# Altium project ALCT_MEZ_LX100.PrjPcb (part 3 of 8)

## Sheet Power.SchDoc: Power
size B; Organization: UCLA High Energy Physics; DocumentNumber: 7; Revision: 2.0; SheetNumber: 7; SheetTotal: 23; CurrentDate: 9/6/2018; ModifiedDate: 9/6/2018; Rule: PcbType=ProtelPcb
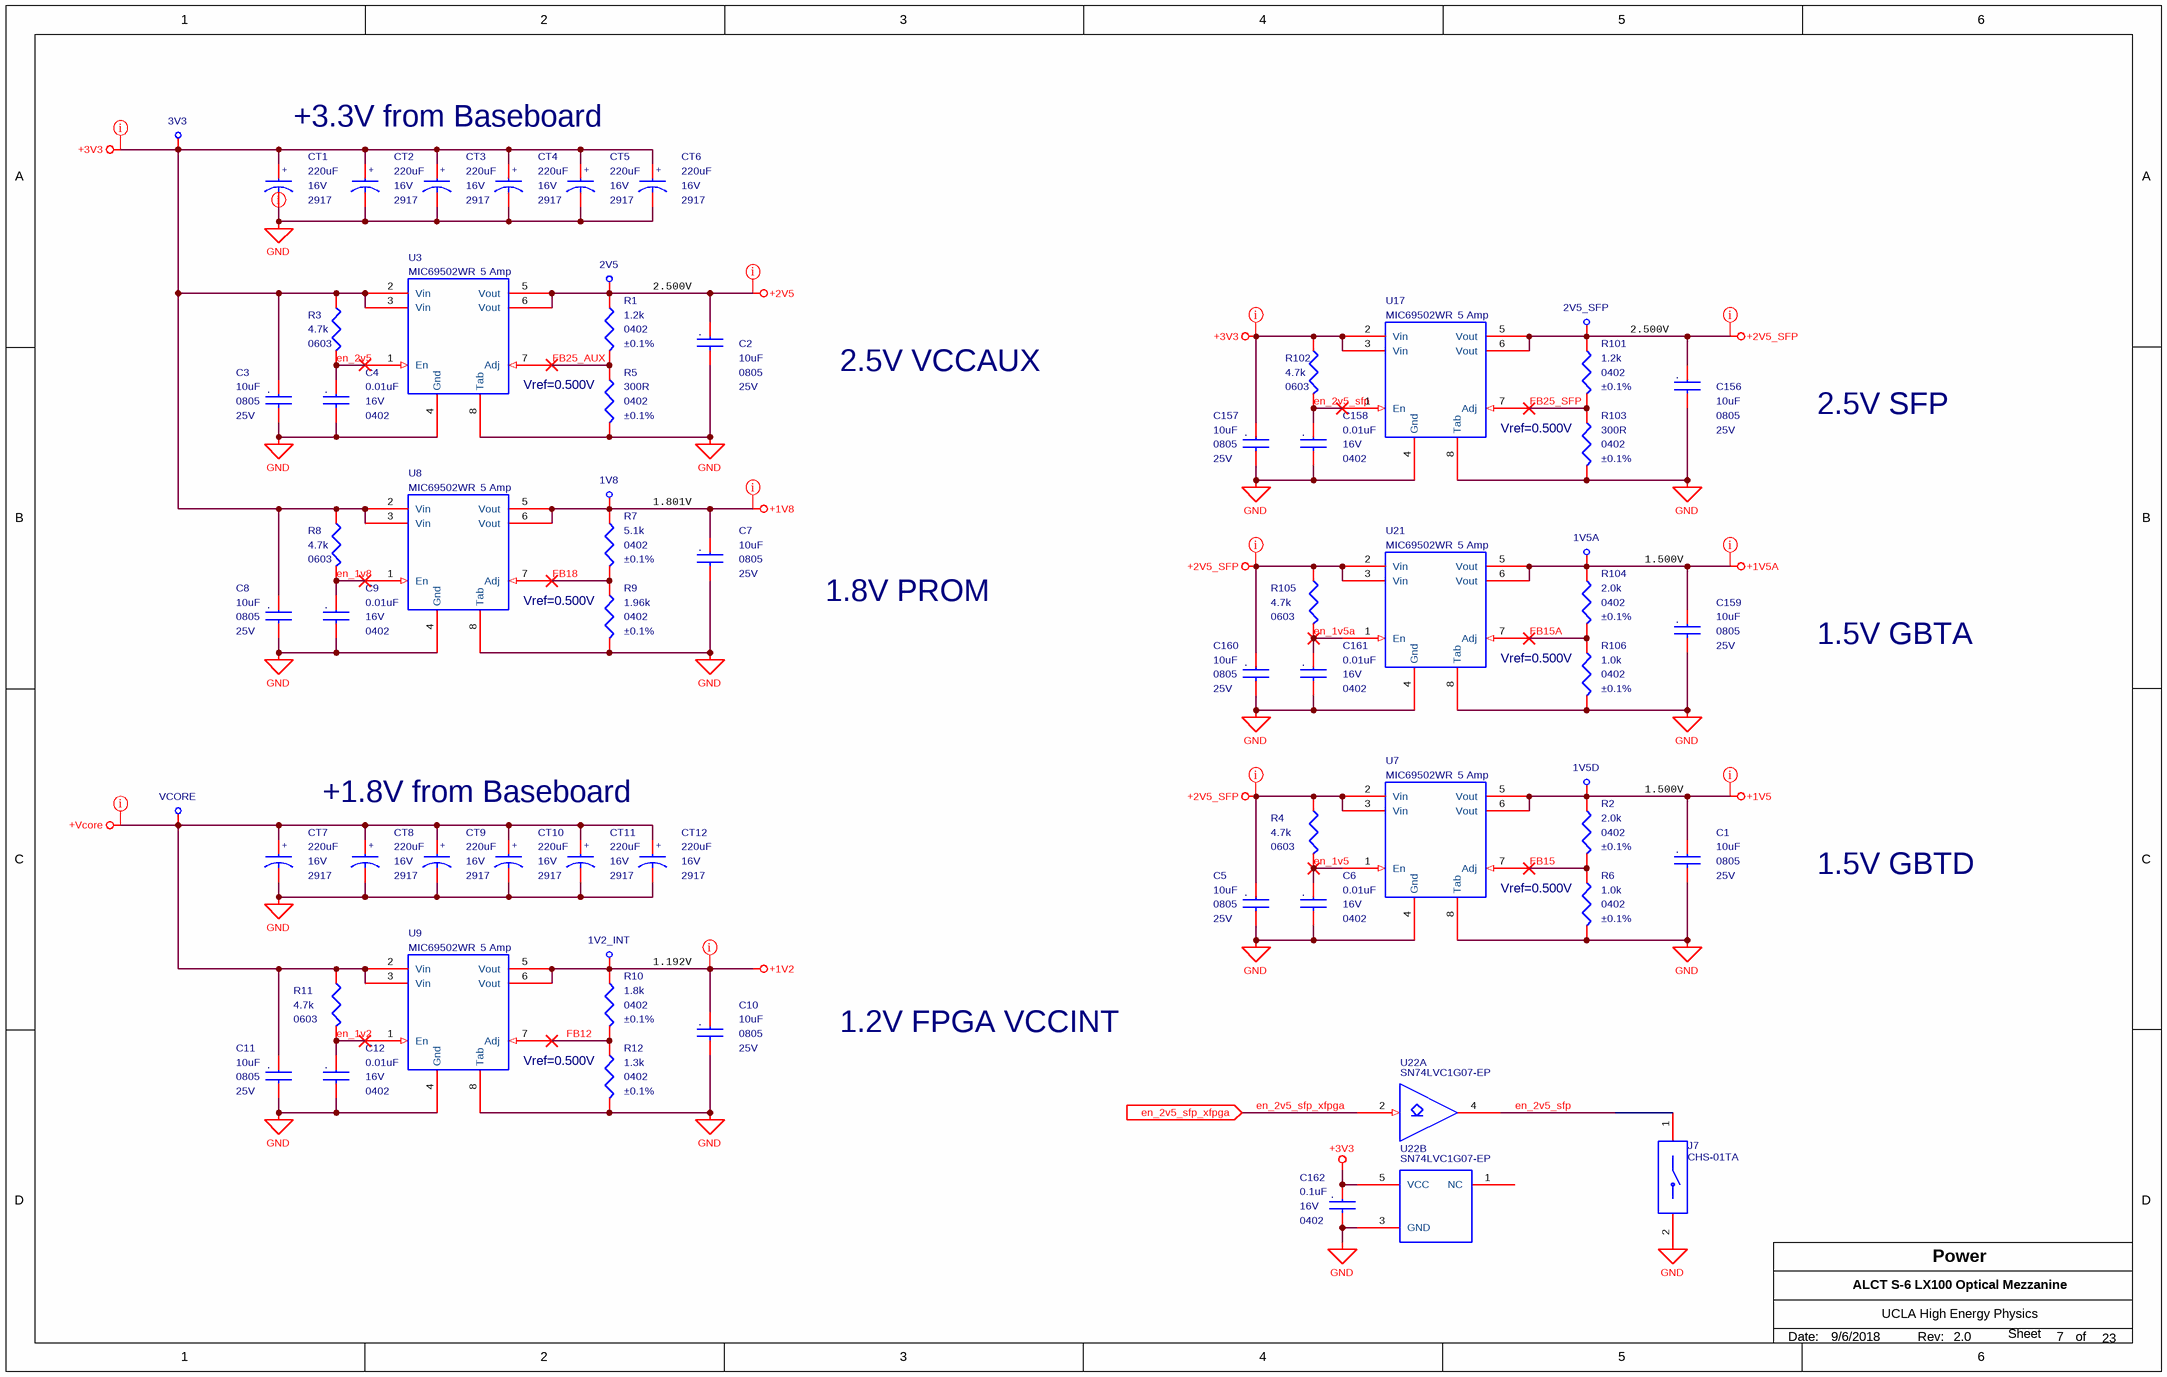
[diagram p12: Power.SchDoc]

### Parts
1V2_INT  Test Point Via  [MC_S6/TH/TPVIA]  (value not drawn)  (no BOM)
1V5A  Test Point Via  [MC_S6/TH/TPVIA]  (value not drawn)  (no BOM)
1V5D  Test Point Via  [MC_S6/TH/TPVIA]  (value not drawn)  (no BOM)
1V8  Test Point Via  [MC_S6/TH/TPVIA]  (value not drawn)  (no BOM)
2V5  Test Point Via  [MC_S6/TH/TPVIA]  (value not drawn)  (no BOM)
2V5_SFP  Test Point Via  [MC_S6/TH/TPVIA]  (value not drawn)  (no BOM)
3V3  Test Point Via  [MC_S6/TH/TPVIA]  (value not drawn)  (no BOM)
C1  10uF  Voltage - Rated: 25V  package: 0805  [MC_S6/SM/C_0805_IPC]
C2  10uF  Voltage - Rated: 25V  package: 0805  [MC_S6/SM/C_0805_IPC]
C3  10uF  Voltage - Rated: 25V  package: 0805  [MC_S6/SM/C_0805_IPC]
C4  0.01uF  Voltage - Rated: 16V  package: 0402  [MC_S6/SM/C_0402_IPC]
C5  10uF  Voltage - Rated: 25V  package: 0805  [MC_S6/SM/C_0805_IPC]
C6  0.01uF  Voltage - Rated: 16V  package: 0402  [MC_S6/SM/C_0402_IPC]
C7  10uF  Voltage - Rated: 25V  package: 0805  [MC_S6/SM/C_0805_IPC]
C8  10uF  Voltage - Rated: 25V  package: 0805  [MC_S6/SM/C_0805_IPC]
C9  0.01uF  Voltage - Rated: 16V  package: 0402  [MC_S6/SM/C_0402_IPC]
C10  10uF  Voltage - Rated: 25V  package: 0805  [MC_S6/SM/C_0805_IPC]
C11  10uF  Voltage - Rated: 25V  package: 0805  [MC_S6/SM/C_0805_IPC]
C12  0.01uF  Voltage - Rated: 16V  package: 0402  [MC_S6/SM/C_0402_IPC]
C156  10uF  Voltage - Rated: 25V  package: 0805  [MC_S6/SM/C_0805_IPC]
C157  10uF  Voltage - Rated: 25V  package: 0805  [MC_S6/SM/C_0805_IPC]
C158  0.01uF  Voltage - Rated: 16V  package: 0402  [MC_S6/SM/C_0402_IPC]
C159  10uF  Voltage - Rated: 25V  package: 0805  [MC_S6/SM/C_0805_IPC]
C160  10uF  Voltage - Rated: 25V  package: 0805  [MC_S6/SM/C_0805_IPC]
C161  0.01uF  Voltage - Rated: 16V  package: 0402  [MC_S6/SM/C_0402_IPC]
C162  0.1uF  package: 0402  Voltage - Rated: 16V  [MC_S6/SM/C_0402_IPC]
CT1  220uF  Voltage - Rated: 16V  package: 2917  [MC_S6/SM/CT_2917_D]
CT2  220uF  Voltage - Rated: 16V  package: 2917  [MC_S6/SM/CT_2917_D]
CT3  220uF  Voltage - Rated: 16V  package: 2917  [MC_S6/SM/CT_2917_D]
CT4  220uF  Voltage - Rated: 16V  package: 2917  [MC_S6/SM/CT_2917_D]
CT5  220uF  Voltage - Rated: 16V  package: 2917  [MC_S6/SM/CT_2917_D]
CT6  220uF  Voltage - Rated: 16V  package: 2917  [MC_S6/SM/CT_2917_D]
CT7  220uF  Voltage - Rated: 16V  package: 2917  [MC_S6/SM/CT_2917_D]
CT8  220uF  Voltage - Rated: 16V  package: 2917  [MC_S6/SM/CT_2917_D]
CT9  220uF  Voltage - Rated: 16V  package: 2917  [MC_S6/SM/CT_2917_D]
CT10  220uF  Voltage - Rated: 16V  package: 2917  [MC_S6/SM/CT_2917_D]
CT11  220uF  Voltage - Rated: 16V  package: 2917  [MC_S6/SM/CT_2917_D]
CT12  220uF  Voltage - Rated: 16V  package: 2917  [MC_S6/SM/CT_2917_D]
J7  CHS-01TA  [CHS-01TA]
R1  1.2k  Tolerance: ±0.1%  package: 0402  [MC_S6/SM/R_0402_IPC]
R2  2.0k  Tolerance: ±0.1%  package: 0402  [MC_S6/SM/R_0402_IPC]
R3  4.7k  Supplier Device Package: 0603  [MC_S6/SM/R_0603_IPC]
R4  4.7k  Supplier Device Package: 0603  [MC_S6/SM/R_0603_IPC]
R5  300R  Tolerance: ±0.1%  package: 0402  [MC_S6/SM/R_0402_IPC]
R6  1.0k  Tolerance: ±0.1%  package: 0402  [MC_S6/SM/R_0402_IPC]
R7  5.1k  Tolerance: ±0.1%  Supplier Device Package: 0402  [MC_S6/SM/R_0402_IPC]
R8  4.7k  Supplier Device Package: 0603  [MC_S6/SM/R_0603_IPC]
R9  1.96k  Tolerance: ±0.1%  package: 0402  [MC_S6/SM/R_0402_IPC]
R10  1.8k  Tolerance: ±0.1%  Supplier Device Package: 0402  [MC_S6/SM/R_0402_IPC]
R11  4.7k  Supplier Device Package: 0603  [MC_S6/SM/R_0603_IPC]
R12  1.3k  Tolerance: ±0.1%  Supplier Device Package: 0402  [MC_S6/SM/R_0402_IPC]
R101  1.2k  Tolerance: ±0.1%  package: 0402  [MC_S6/SM/R_0402_IPC]
R102  4.7k  Supplier Device Package: 0603  [MC_S6/SM/R_0603_IPC]
R103  300R  Tolerance: ±0.1%  package: 0402  [MC_S6/SM/R_0402_IPC]
R104  2.0k  Tolerance: ±0.1%  package: 0402  [MC_S6/SM/R_0402_IPC]
R105  4.7k  Supplier Device Package: 0603  [MC_S6/SM/R_0603_IPC]
R106  1.0k  Tolerance: ±0.1%  package: 0402  [MC_S6/SM/R_0402_IPC]
U3  MIC69502WR  [MC_S6/SM/SPAK7]
U7  MIC69502WR  [MC_S6/SM/SPAK7]
U8  MIC69502WR  [MC_S6/SM/SPAK7]
U9  MIC69502WR  [MC_S6/SM/SPAK7]
U17  MIC69502WR  [MC_S6/SM/SPAK7]
U21  MIC69502WR  [MC_S6/SM/SPAK7]
U22  SN74LVC1G07-EP  [SOT353-1]  (parts A,B of 2)
VCORE  Test Point Via  [MC_S6/TH/TPVIA]  (value not drawn)  (no BOM)

### Ports
en_2v5_sfp_xfpga (in)

### Nets
+1V2: 1V2_INT.1(In) C10.1 R10.1 U9.5(Vout) U9.6(Vout)
+1V5: 1V5D.1(In) C1.1 R2.1 U7.5(Vout) U7.6(Vout)
+1V5A: 1V5A.1(In) C159.1 R104.1 U21.5(Vout) U21.6(Vout)
+1V8: 1V8.1(In) C7.1 R7.1 U8.5(Vout) U8.6(Vout)
+2V5: 2V5.1(In) C2.1 R1.1 U3.5(Vout) U3.6(Vout)
+2V5_SFP: 2V5_SFP.1(In) C5.1 C156.1 C160.1 R4.1 R101.1 R105.1 U7.2(Vin) U7.3(Vin) U17.5(Vout) U17.6(Vout) U21.2(Vin) U21.3(Vin)
+3V3: 3V3.1(In) C3.1 C8.1 C157.1 C162.1 CT1.1 CT2.1 CT3.1 CT4.1 CT5.1 CT6.1 R3.1 R8.1 R102.1 U3.2(Vin) U3.3(Vin) U8.2(Vin) U8.3(Vin) U17.2(Vin) U17.3(Vin) U22.5(VCC)
+Vcore: C11.1 CT7.1 CT8.1 CT9.1 CT10.1 CT11.1 CT12.1 R11.1 U9.2(Vin) U9.3(Vin) VCORE.1(In)
GND: C1.2 C2.2 C3.2 C4.2 C5.2 C6.2 C7.2 C8.2 C9.2 C10.2 C11.2 C12.2 C156.2 C157.2 C158.2 C159.2 C160.2 C161.2 C162.2 CT1.2 CT2.2 CT3.2 CT4.2 CT5.2 CT6.2 CT7.2 CT8.2 CT9.2 CT10.2 CT11.2 CT12.2 J7.2 R5.2 R6.2 R9.2 R12.2 R103.2 R106.2 U3.4(Gnd) U3.8(Tab) U7.4(Gnd) U7.8(Tab) U8.4(Gnd) U8.8(Tab) U9.4(Gnd) U9.8(Tab) U17.4(Gnd) U17.8(Tab) U21.4(Gnd) U21.8(Tab) U22.3(GND)
en_1v2: C12.1 R11.2 U9.1(En)
en_1v5: C6.1 R4.2 U7.1(En)
en_1v5a: C161.1 R105.2 U21.1(En)
en_1v8: C9.1 R8.2 U8.1(En)
en_2v5: C4.1 R3.2 U3.1(En)
en_2v5_sfp: C158.1 J7.1 R102.2 U17.1(En) U22.4(Y)
en_2v5_sfp_xfpga: U22.2(A) ; port en_2v5_sfp_xfpga
FB12: R10.2 R12.1 U9.7(Adj)
FB15: R2.2 R6.1 U7.7(Adj)
FB15A: R104.2 R106.1 U21.7(Adj)
FB18: R7.2 R9.1 U8.7(Adj)
FB25_AUX: R1.2 R5.1 U3.7(Adj)
FB25_SFP: R101.2 R103.1 U17.7(Adj)

Not connected (* = marked no-connect by the designer): U22 1(NC)

### Layout directives
net class Power: +1V2, +1V5, +1V5A, +1V8, +2V5, +2V5_SFP, +3V3, +Vcore, GND

### Notes on the sheet
- +3.3V from Baseboard
- (near U3) 5 Amp
- 2.500V
- (near U17) 5 Amp
- Vref=0.500V
- 2.5V VCCAUX
- 2.5V SFP
- (near U8) 5 Amp
- 1.801V
- 1.8V PROM
- (near U21) 5 Amp
- 1.500V
- 1.5V GBTA
- +1.8V from Baseboard
- (near U7) 5 Amp
- 1.5V GBTD
- (near U9) 5 Amp
- 1.192V
- 1.2V FPGA VCCINT
- Date:
- Rev:
- of
- Sheet
- (in symbol C0402C103K4RACTU) .
- (in symbol C0402C104K4RACTU) .
- (in symbol GRM21BR61E106KA73L) .
- (in symbol T491D227K016AT) +

### Library data of the parts
1V2_INT 1V5A 1V5D 1V8 2V5 2V5_SFP 3V3 VCORE = TPVIA: COMPSIDE: TOP; COMPGROUP: 0; mfgr: Layout; COMPROT: 0; Package: 90; mfgr_id: TPVIA; mfgr_foot: TPVIA
C1-C3 C5 C7 C8 C10 C11 C156 C157 C159 C160 = GRM21BR61E106KA73L: CAP CER 10UF 25V X5R 0805; Manufacturer: Murata Electronics North America; Capacitance: 10µF; Tolerance: ±10%; Supplier 1: Digi-Key; Manufacturer Part Number: GRM21BR61E106KA73L; RoHS: RoHS Compliant; Category: Capacitors; Stock 1: 607428; Pricing 1: 1=0.19, 10=0.13, 50=0.0748, 100=0.0618, 250=0.052, 500=0.04356, 1000=0.03575 (USD); Packaging: Cut Tape (CT); Part Status: Active; Temperature Coefficient: X5R; Operating Temperature: -55°C ~ 85°C; Features: -; Ratings: -; Applications: General Purpose; Mounting Type: Surface Mount, MLCC; Package / Case: 0805 (2012 Metric); Size / Dimension: 0.079" L x 0.049" W (2.00mm x 1.25mm); Height - Seated (Max): -; Thickness (Max): 0.053" (1.35mm); Lead Spacing: -; Lead Style: -; ComponentLink1URL: http://www.murata.com/~/media/webrenewal/support/library/catalog/products/capacitor/mlcc/c02e.pdf; ComponentLink1Description: http://www.murata.com/~/media/webrenewal/support/library/catalog/products/capacitor/mlcc/c02e.pdf; Supplier 2: Digi-Key; Supplier Part Number 1: 490-5523-1-ND; Supplier Part Number 2: 490-5523-6-ND
C4 C6 C9 C12 C158 C161 = C0402C103K4RACTU: CAP CER 10nF 16V X7R 0402; Manufacturer: KEMET; Capacitance: 10000pF; Tolerance: ±10%; Supplier 1: Digi-Key; Manufacturer Part Number: C0402C103K4RACTU; RoHS: RoHS Compliant; Category: Capacitors; Stock 1: 605739; Pricing 1: 1=0.1, 10=0.02, 25=0.0144, 50=0.0108, 100=0.0088, 250=0.00732, 500=0.00626, 1000=0.00492, 5000=0.00412 (USD); Packaging: Cut Tape (CT); Part Status: Active; Temperature Coefficient: X7R; Operating Temperature: -55°C ~ 125°C; Features: -; Ratings: -; Applications: General Purpose; Failure Rate: -; Mounting Type: Surface Mount, MLCC; Package / Case: 0402 (1005 Metric); Size / Dimension: 0.039" L x 0.020" W (1.00mm x 0.50mm); Height - Seated (Max): -; Thickness (Max): 0.022" (0.55mm); Lead Spacing: -; Lead Style: -; ComponentLink1URL: http://www.kemet.com/docfinder?Partnumber=C0402C103K4RACTU; ComponentLink1Description: http://www.kemet.com/docfinder?Partnumber=C0402C103K4RACTU; Supplier 2: Digi-Key; Stock 2: 605739; Pricing 2: 1=0.1, 10=0.02, 25=0.0144, 50=0.0108, 100=0.0088, 250=0.00732, 500=0.00626, 1000=0.00492, 5000=0.00412 (USD); Supplier Part Number 1: 399-1038-1-ND; Supplier Part Number 2: 399-1038-6-ND
C162 = C0402C104K4RACTU: CAP CER 0.1UF 16V X7R 0402; Manufacturer: KEMET; Capacitance: 0.10µF; Tolerance: ±10%; Supplier 1: Digi-Key; Manufacturer Part Number: C0402C104K4RACTU; RoHS: RoHS Compliant; Category: Capacitors; Stock 1: 3565698; Pricing 1: 1=0.11, 10=0.078, 25=0.0568, 50=0.0442, 100=0.0365, 250=0.03024, 500=0.02562, 1000=0.02121, 5000=0.01806 (USD); Packaging: Cut Tape (CT); Part Status: Active; Operating Temperature: -55°C ~ 125°C; Features: -; Ratings: -; Applications: General Purpose; Failure Rate: -; Mounting Type: Surface Mount, MLCC; Package / Case: 0402 (1005 Metric); Size / Dimension: 0.039" L x 0.020" W (1.00mm x 0.50mm); Height - Seated (Max): -; Thickness (Max): 0.022" (0.55mm); Lead Spacing: -; Lead Style: -; ComponentLink1URL: http://www.kemet.com/docfinder?Partnumber=C0402C104K4RACTU; ComponentLink1Description: http://www.kemet.com/docfinder?Partnumber=C0402C104K4RACTU; Supplier 2: Digi-Key; Stock 2: 3565998; Pricing 2: 1=0.11, 10=0.078, 25=0.0568, 50=0.0442, 100=0.0365, 250=0.03024, 500=0.02562, 1000=0.02121, 5000=0.01806 (USD); Supplier Part Number 1: 399-3521-1-ND; Supplier Part Number 2: 399-3521-6-ND; Temperature Coefficient: X7R
CT1-CT12 = T491D227K016AT: CAP TANT 220UF 16V 10% 2917; Manufacturer: KEMET; Manufacturer Size Code: D; Capacitance: 220µF; ESR (Equivalent Series Resistance): 500 mOhm; Lifetime @ Temp.: 2000 Hrs @ 85°C; Supplier 1: Digi-Key; Manufacturer Part Number: T491D227K016AT; RoHS: RoHS Compliant; Category: Capacitors; Stock 1: 48724; Pricing 1: 1=1.28, 10=1.009, 25=0.9248, 50=0.8744, 100=0.7568, 250=0.67268 (USD); Packaging: Cut Tape (CT); Part Status: Active; Tolerance: ±10%; Type: Molded; Operating Temperature: -55°C ~ 125°C; Mounting Type: Surface Mount; Package / Case: 2917 (7343 Metric); Size / Dimension: 0.287" L x 0.169" W (7.30mm x 4.30mm); Height - Seated (Max): 0.122" (3.10mm); Lead Spacing: -; Features: General Purpose; Failure Rate: -; ComponentLink1URL: http://www.kemet.com/Lists/ProductCatalog/Attachments/254/KEM_T2005_T491.pdf; ComponentLink1Description: http://www.kemet.com/Lists/ProductCatalog/Attachments/254/KEM_T2005_T491.pdf; Supplier 2: Digi-Key; Stock 2: 48724; Pricing 2: 1=1.28, 10=1.009, 25=0.9248, 50=0.8744, 100=0.7568, 250=0.67268 (USD); Supplier Part Number 1: 399-10429-1-ND; Supplier Part Number 2: 399-10429-6-ND
J7 = CHS-01TA: SWITCH SLIDE DIP SPST 100MA 6V; Manufacturer: Nidec Copal; Body Material: Polyphenylene; Number of Positions: 1; Electrical Life: 2000Cycles; Max Voltage Rating (DC): 24V; Pitch: 0.05inch; Washable: Yes; ComponentLink1URL: https://www.ctscorp.com/wp-content/uploads/219.pdf; ComponentLink1Description: https://www.ctscorp.com/wp-content/uploads/219.pdf; Supplier 1: Digi-Key; Manufacturer Part Number: CHS-01TA; Stock 1: 148558; Pricing 1: 1=0.98, 10=0.961, 25=0.9056, 50=0.85, 100=0.8131, 250=0.77616, 500=0.70224 (USD); Mount: Surface Mount; Contact Material: Copper Alloy; Contact Plating: Gold; Min Operating Temperature: -40°C; Max Operating Temperature: 85°C; Packaging: Tape and Reel; Throw Configuration: SPST; Voltage Rating (DC): 6V; Current Rating: 100mA; Termination: J-Hook; Orientation: Vertical; Length: 0.098inch; Lead Free: Lead Free; ComponentLink2URL: https://datasheet.ciiva.com/2863/chs-2863448.pdf; ComponentLink2Description: https://datasheet.ciiva.com/2863/chs-2863448.pdf; ComponentLink3URL: https://datasheet.ciiva.com/2863/chs-2863449.pdf; ComponentLink3Description: https://datasheet.ciiva.com/2863/chs-2863449.pdf; ComponentLink4URL: https://datasheet.ciiva.com/2863/chs-2863450.pdf; ComponentLink4Description: https://datasheet.ciiva.com/2863/chs-2863450.pdf; Supplier Part Number 1: 563-1003-1-ND
R1 R101 = ERA-2AEB122X: RES SMD 1.2K OHM 0.1% 1/16W 0402; Manufacturer: Panasonic Electronic Components; Power (Watts): 0.063W, 1/16W; Temperature Coefficient: ±25ppm/°C; Supplier 1: Digi-Key; Manufacturer Part Number: ERA-2AEB122X; RoHS: RoHS Compliant; Category: Resistors; Stock 1: 25790; Pricing 1: 1=0.45, 10=0.321, 100=0.1283, 1000=0.06322, 2500=0.05858, 5000=0.053 (USD); Packaging: Cut Tape (CT); Part Status: Active; Composition: Thin Film; Features: Automotive AEC-Q200; Operating Temperature: -55°C ~ 155°C; Package / Case: 0402 (1005 Metric); Size / Dimension: 0.039" L x 0.020" W (1.00mm x 0.50mm); Height - Seated (Max): 0.016" (0.40mm); Failure Rate: -; ComponentLink1URL: https://industrial.panasonic.com/cdbs/www-data/pdf/RDM0000/AOA0000C307.pdf; ComponentLink1Description: https://industrial.panasonic.com/cdbs/www-data/pdf/RDM0000/AOA0000C307.pdf; Supplier 2: Digi-Key; Stock 2: 25790; Pricing 2: 1=0.45, 10=0.321, 100=0.1283, 1000=0.06322, 2500=0.05858, 5000=0.053 (USD); Supplier Part Number 1: P1.2KDCCT-ND; Supplier Part Number 2: P1.2KDCDKR-ND; Supplier Device Package: 0402
R2 R104 = ERA-2AEB202X: RES SMD 2.0K OHM 0.1% 1/16W 0402; Manufacturer: Panasonic Electronic Components; Power (Watts): 0.063W, 1/16W; Temperature Coefficient: ±25ppm/°C; Supplier 1: Digi-Key; Manufacturer Part Number: ERA-2AEB202X; RoHS: RoHS Compliant; Category: Resistors; Stock 1: 204508; Pricing 1: 1=0.45, 10=0.321, 100=0.1283, 1000=0.06322, 2500=0.05858, 5000=0.053 (USD); Packaging: Digi-Reel®; Part Status: Active; Composition: Thin Film; Features: Automotive AEC-Q200; Operating Temperature: -55°C ~ 155°C; Package / Case: 0402 (1005 Metric); Size / Dimension: 0.039" L x 0.020" W (1.00mm x 0.50mm); Height - Seated (Max): 0.016" (0.40mm); Failure Rate: -; ComponentLink1URL: https://industrial.panasonic.com/cdbs/www-data/pdf/RDM0000/AOA0000C307.pdf; ComponentLink1Description: https://industrial.panasonic.com/cdbs/www-data/pdf/RDM0000/AOA0000C307.pdf; Supplier 2: Digi-Key; Stock 2: 204508; Pricing 2: 1=0.45, 10=0.321, 100=0.1283, 1000=0.06322, 2500=0.05858, 5000=0.053 (USD); Supplier Part Number 1: P2.0KDCDKR-ND; Supplier Part Number 2: P2.0KDCCT-ND; Supplier Device Package: 0402
R3 R4 R8 R11 R102 R105 = CR0603-FX-4701ELF: RES SMD 4.7K OHM 1% 1/10W 0603; Manufacturer: Bourns Inc.; Power (Watts): 0.1W, 1/10W; Temperature Coefficient: ±100ppm/°C; Tolerance: ±1%; Supplier 1: Digi-Key; Manufacturer Part Number: CR0603-FX-4701ELF; RoHS: RoHS Compliant; Category: Resistors; Stock 1: 43560; Pricing 1: 1=0.1, 10=0.021, 100=0.0086, 1000=0.00385, 2500=0.00334 (USD); Packaging: Cut Tape (CT); Part Status: Active; Resistance (Ohms): 4.7k; Composition: Thick Film; Features: Moisture Resistant; Operating Temperature: -55°C ~ 155°C; Package / Case: 0603 (1608 Metric); Size / Dimension: 0.063" L x 0.031" W (1.60mm x 0.80mm); Height - Seated (Max): 0.022" (0.55mm); Failure Rate: -; ComponentLink1URL: http://www.bourns.com/docs/Product-Datasheets/CHPREZTR.pdf; ComponentLink1Description: http://www.bourns.com/docs/Product-Datasheets/CHPREZTR.pdf; Supplier 2: Digi-Key; Stock 2: 43560; Pricing 2: 1=0.1, 10=0.021, 100=0.0086, 1000=0.00385, 2500=0.00334 (USD); Supplier Part Number 1: CR0603-FX-4701ELFCT-ND; Supplier Part Number 2: CR0603-FX-4701ELFDKR-ND
R5 R103 = ERA-2AEB301X: RES SMD 300 OHM 0.1% 1/16W 0402; Manufacturer: Panasonic Electronic Components; Power (Watts): 0.063W, 1/16W; Temperature Coefficient: ±25ppm/°C; Supplier 1: Digi-Key; Manufacturer Part Number: ERA-2AEB301X; RoHS: RoHS Compliant; Category: Resistors; Stock 1: 31760; Pricing 1: 1=0.45, 10=0.321, 100=0.1283, 1000=0.06322, 2500=0.05858, 5000=0.053 (USD); Packaging: Cut Tape (CT); Part Status: Active; Composition: Thin Film; Features: Automotive AEC-Q200; Operating Temperature: -55°C ~ 155°C; Package / Case: 0402 (1005 Metric); Supplier Device Package: 0402; Size / Dimension: 0.039" L x 0.020" W (1.00mm x 0.50mm); Height - Seated (Max): 0.016" (0.40mm); Failure Rate: -; ComponentLink1URL: https://industrial.panasonic.com/cdbs/www-data/pdf/RDM0000/AOA0000C307.pdf; ComponentLink1Description: https://industrial.panasonic.com/cdbs/www-data/pdf/RDM0000/AOA0000C307.pdf; Supplier 2: Digi-Key; Stock 2: 31760; Pricing 2: 1=0.45, 10=0.321, 100=0.1283, 1000=0.06322, 2500=0.05858, 5000=0.053 (USD); Supplier Part Number 1: P300DCCT-ND; Supplier Part Number 2: P300DCDKR-ND
R6 R106 = ERA-2AEB102X: RES SMD 1.0K OHM 0.1% 1/16W 0402; Manufacturer: Panasonic Electronic Components; Power (Watts): 0.063W, 1/16W; Temperature Coefficient: ±25ppm/°C; Supplier 1: Digi-Key; Manufacturer Part Number: ERA-2AEB102X; RoHS: RoHS Compliant; Category: Resistors; Stock 1: 473705; Pricing 1: 1=0.45, 10=0.321, 100=0.1283, 1000=0.06322, 2500=0.05858, 5000=0.053 (USD); Packaging: Cut Tape (CT); Part Status: Active; Composition: Thin Film; Features: Automotive AEC-Q200; Operating Temperature: -55°C ~ 155°C; Package / Case: 0402 (1005 Metric); Size / Dimension: 0.039" L x 0.020" W (1.00mm x 0.50mm); Height - Seated (Max): 0.016" (0.40mm); Failure Rate: -; ComponentLink1URL: https://industrial.panasonic.com/cdbs/www-data/pdf/RDM0000/AOA0000C307.pdf; ComponentLink1Description: https://industrial.panasonic.com/cdbs/www-data/pdf/RDM0000/AOA0000C307.pdf; Supplier 2: Digi-Key; Stock 2: 473705; Pricing 2: 1=0.45, 10=0.321, 100=0.1283, 1000=0.06322, 2500=0.05858, 5000=0.053 (USD); Supplier Part Number 1: P1.0KDCCT-ND; Supplier Part Number 2: P1.0KDCDKR-ND; Supplier Device Package: 0402
R7 = ERA-2AEB512X: RES SMD 5.1K OHM 0.1% 1/16W 0402; Manufacturer: Panasonic Electronic Components; Power (Watts): 0.063W, 1/16W; Temperature Coefficient: ±25ppm/°C; Supplier 1: Digi-Key; Manufacturer Part Number: ERA-2AEB512X; RoHS: RoHS Compliant; Category: Resistors; Stock 1: 26098; Pricing 1: 1=0.61, 50=0.238, 100=0.1913, 250=0.14876, 500=0.1122, 1000=0.0867, 5000=0.0646 (USD); Packaging: Cut Tape (CT); Part Status: Active; Resistance (Ohms): 5.1k; Composition: Thin Film; Features: Automotive AEC-Q200; Operating Temperature: -55°C ~ 155°C; Package / Case: 0402 (1005 Metric); Size / Dimension: 0.039" L x 0.020" W (1.00mm x 0.50mm); Height - Seated (Max): 0.016" (0.40mm); Failure Rate: -; ComponentLink1URL: https://industrial.panasonic.com/cdbs/www-data/pdf/RDA0000/AOA0000C237.pdf; ComponentLink1Description: https://industrial.panasonic.com/cdbs/www-data/pdf/RDA0000/AOA0000C237.pdf; Supplier 2: Digi-Key; Stock 2: 26098; Pricing 2: 1=0.61, 50=0.238, 100=0.1913, 250=0.14876, 500=0.1122, 1000=0.0867, 5000=0.0646 (USD); Supplier Part Number 1: P5.1KDCCT-ND; Supplier Part Number 2: P5.1KDCDKR-ND; Number of Terminations: 2
R9 = ERA-2AEB1961X: RES SMD 1.96K OHM 0.1% 1/16W 0402; Manufacturer: Panasonic Electronic Components; Power (Watts): 0.063W, 1/16W; Temperature Coefficient: ±25ppm/°C; Supplier 1: Digi-Key; Manufacturer Part Number: ERA-2AEB1961X; RoHS: RoHS Compliant; Category: Resistors; Stock 1: 36796; Pricing 1: 1=0.45, 10=0.321, 100=0.1283, 1000=0.06322, 2500=0.05858, 5000=0.053 (USD); Packaging: Cut Tape (CT); Part Status: Active; Composition: Thin Film; Features: Automotive AEC-Q200; Operating Temperature: -55°C ~ 155°C; Package / Case: 0402 (1005 Metric); Size / Dimension: 0.039" L x 0.020" W (1.00mm x 0.50mm); Height - Seated (Max): 0.016" (0.40mm); Failure Rate: -; ComponentLink1URL: https://industrial.panasonic.com/cdbs/www-data/pdf/RDM0000/AOA0000C307.pdf; ComponentLink1Description: https://industrial.panasonic.com/cdbs/www-data/pdf/RDM0000/AOA0000C307.pdf; Supplier 2: Digi-Key; Stock 2: 36796; Pricing 2: 1=0.45, 10=0.321, 100=0.1283, 1000=0.06322, 2500=0.05858, 5000=0.053 (USD); Supplier Part Number 1: P1.96KDCCT-ND; Supplier Part Number 2: P1.96KDCDKR-ND; Supplier Device Package: 0402
R10 = ERA-2AEB182X: RES SMD 1.8k OHM 0.1% 1/16W 0402; Manufacturer: Panasonic Electronic Components; Power (Watts): 0.063W, 1/16W; Temperature Coefficient: ±25ppm/°C; Supplier 1: Digi-Key; Manufacturer Part Number: ERA-2AEB182X; RoHS: RoHS Compliant; Category: Resistors; Stock 1: 39375; Pricing 1: 1=0.6, 50=0.2484, 100=0.2052, 250=0.162, 500=0.13824, 1000=0.10368, 5000=0.07776 (USD); Packaging: Cut Tape (CT); Part Status: Active; Resistance (Ohms): 1.8k; Composition: Thin Film; Features: Automotive AEC-Q200; Operating Temperature: -55°C ~ 155°C; Package / Case: 0402 (1005 Metric); Size / Dimension: 0.039" L x 0.020" W (1.00mm x 0.50mm); Height - Seated (Max): 0.016" (0.40mm); Failure Rate: -; ComponentLink1URL: https://industrial.panasonic.com/cdbs/www-data/pdf/RDA0000/AOA0000C237.pdf; ComponentLink1Description: https://industrial.panasonic.com/cdbs/www-data/pdf/RDA0000/AOA0000C237.pdf; Supplier 2: Digi-Key; Stock 2: 39375; Pricing 2: 1=0.6, 50=0.2484, 100=0.2052, 250=0.162, 500=0.13824, 1000=0.10368, 5000=0.07776 (USD); Supplier Part Number 1: P1.8KDCCT-ND; Supplier Part Number 2: P1.8KDCDKR-ND; Number of Terminations: 2
R12 = ERA-2AEB132X: RES SMD 1.3k OHM 0.1% 1/16W 0402; Manufacturer: Panasonic Electronic Components; Power (Watts): 0.063W, 1/16W; Temperature Coefficient: ±25ppm/°C; Supplier 1: Digi-Key; Manufacturer Part Number: ERA-2AEB132X; RoHS: RoHS Compliant; Category: Resistors; Stock 1: 249; Pricing 1: 1=0.45, 10=0.321, 100=0.1283, 1000=0.06322, 2500=0.05858, 5000=0.053 (USD); Packaging: Cut Tape (CT); Part Status: Active; Composition: Thin Film; Features: Automotive AEC-Q200; Operating Temperature: -55°C ~ 155°C; Package / Case: 0402 (1005 Metric); Size / Dimension: 0.039" L x 0.020" W (1.00mm x 0.50mm); Height - Seated (Max): 0.016" (0.40mm); Failure Rate: -; ComponentLink1URL: https://industrial.panasonic.com/cdbs/www-data/pdf/RDM0000/AOA0000C307.pdf; ComponentLink1Description: https://industrial.panasonic.com/cdbs/www-data/pdf/RDM0000/AOA0000C307.pdf; Supplier 2: Digi-Key; Stock 2: 249; Pricing 2: 1=0.45, 10=0.321, 100=0.1283, 1000=0.06322, 2500=0.05858, 5000=0.053 (USD); Supplier Part Number 1: P1.3KDCCT-ND; Supplier Part Number 2: P1.3KDCDKR-ND
U3 U7-U9 U17 U21 = MIC69502WR: IC REG LDO ADJ 5A SPAK-7; Manufacturer: Microchip Technology; Control Features: Enable; Output Configuration: Positive; Output Type: Adjustable; Protection Features: Over Current, Over Temperature; Voltage - Input (Max): 5.5V; Voltage - Output (Min/Fixed): 0.5V; Voltage Dropout (Max): 0.5V @ 5A; Category: Integrated Circuits (ICs); ComponentLink1Description: http://www.microchip.com/mymicrochip/filehandler.aspx?ddocname=en580586; ComponentLink1URL: http://www.microchip.com/mymicrochip/filehandler.aspx?ddocname=en580586; Current - Output: 5A; Manufacturer Part Number: MIC69502WR; Mounting Type: Surface Mount; Operating Temperature: -40°C ~ 125°C; Package / Case: SPak-7 (7 leads + Tab); Packaging: Tube; Part Status: Active; Pricing 1: 1=2.98, 25=2.4884, 100=2.2575 (USD); PSRR: -; RoHS: RoHS Compliant; Stock 1: 2547; Supplier 1: Digi-Key; Supplier Device Package: S-PAK-7; Supplier Part Number 1: 576-1613-ND; Voltage - Output (Max): 5.5V
U22 = SN74LVC1G07-EP: IC BUFF/DVR NON-INVERT Open Drain SC70-5; Manufacturer: Texas Instruments; mfgr_id: SN74LVC1G07MDCKREP; mfgr: Texas Inst; mfgr_foot: DCK; COMPROT: 270; COMPGROUP: 0; COMPSIDE: TOP; Logic Type: Buffer, Non-Inverting; Number of Bits per Element: 1; Current - Output High, Low: -, 32mA; Voltage - Supply: 1.65 V ~ 5.5 V; Package: 99; Supplier 1: Digi-Key; Manufacturer Part Number: SN74LVC1G07MDCKREP; RoHS: RoHS Compliant; Category: Integrated Circuits (ICs); Stock 1: 4252; Pricing 1: 1=0.81, 10=0.714, 100=0.5472, 500=0.4326, 1000=0.34608 (USD); Packaging: Cut Tape (CT); Part Status: Active; Input Type: -; Output Type: Open Drain; Operating Temperature: -55°C ~ 125°C (TA); Mounting Type: Surface Mount; Package / Case: 5-TSSOP, SC-70-5, SOT-353; Supplier Device Package: SC-70-5; ComponentLink1URL: http://www.ti.com/lit/ds/symlink/sn74lvc1g07-ep.pdf; ComponentLink1Description: http://www.ti.com/lit/ds/symlink/sn74lvc1g07-ep.pdf; Supplier 2: Digi-Key; Stock 2: 4252; Pricing 2: 1=0.81, 10=0.714, 100=0.5472, 500=0.4326, 1000=0.34608 (USD); Supplier Part Number 1: 296-22343-1-ND; Supplier Part Number 2: 296-22343-6-ND

## Sheet ADC.SchDoc: ADC
size A; Organization: UCLA High Energy Physics; DocumentNumber: 8; Revision: 2.0; SheetNumber: 8; SheetTotal: 23; CurrentDate: 9/6/2018; ModifiedDate: 9/6/2018
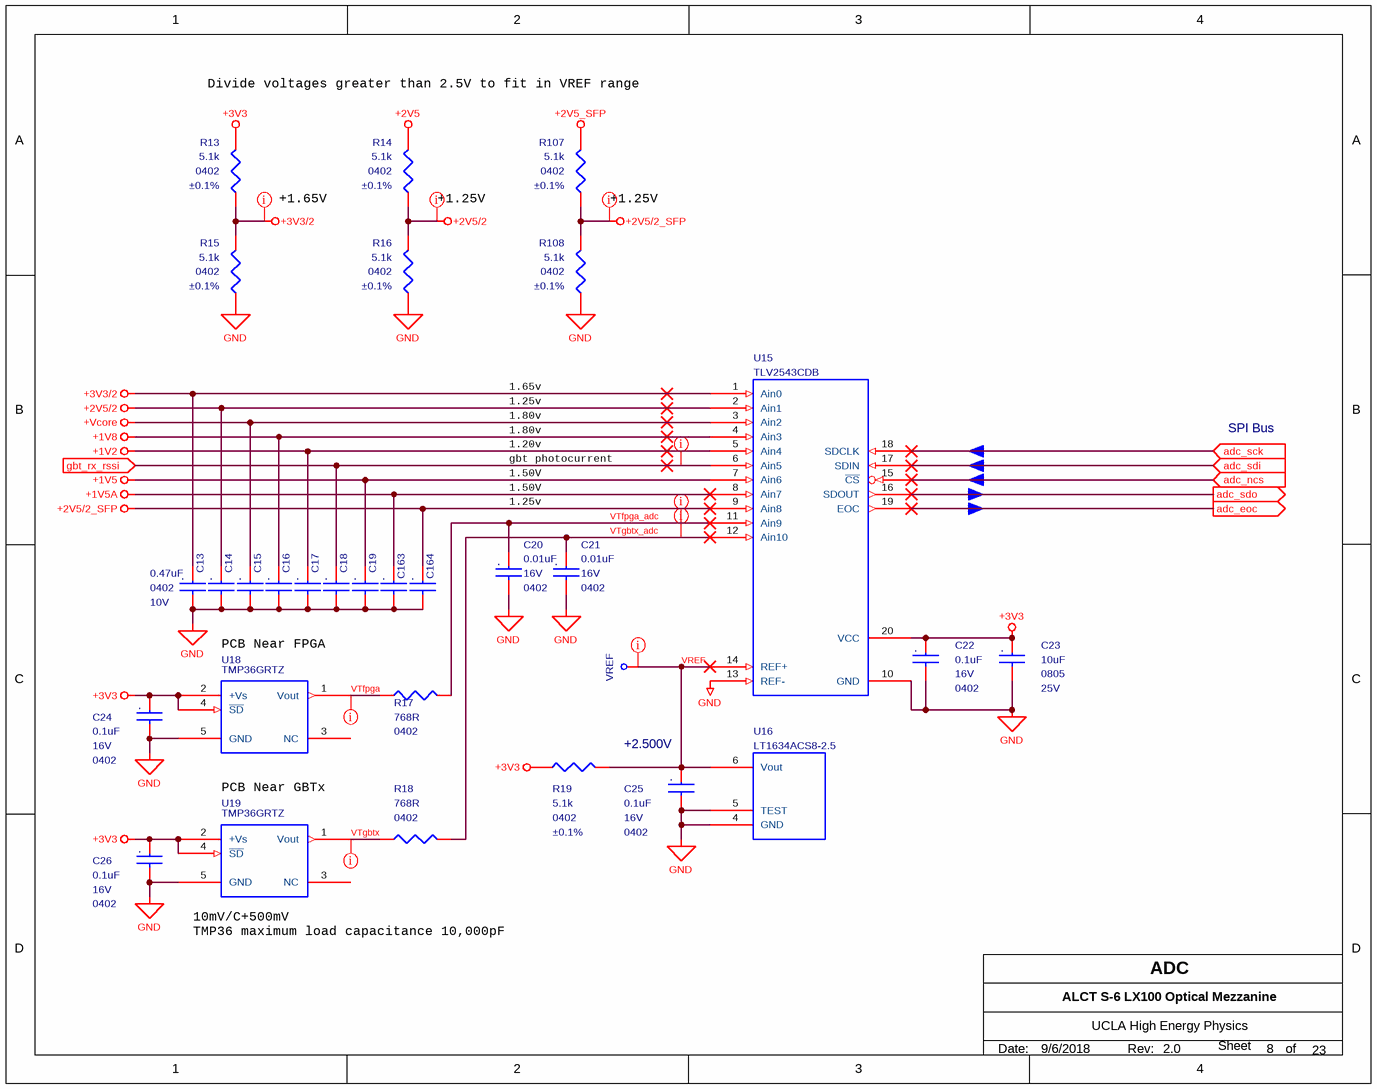
[diagram p13: ADC.SchDoc]

### Parts
C13  0.47uF  package: 0402  Voltage - Rated: 10V  [MC_S6/SM/C_0402_IPC]
C14  0.47uF  [MC_S6/SM/C_0402_IPC]  (value not drawn)
C15  0.47uF  [MC_S6/SM/C_0402_IPC]  (value not drawn)
C16  0.47uF  [MC_S6/SM/C_0402_IPC]  (value not drawn)
C17  0.47uF  [MC_S6/SM/C_0402_IPC]  (value not drawn)
C18  0.47uF  [MC_S6/SM/C_0402_IPC]  (value not drawn)
C19  0.47uF  [MC_S6/SM/C_0402_IPC]  (value not drawn)
C20  0.01uF  Voltage - Rated: 16V  package: 0402  [MC_S6/SM/C_0402_IPC]
C21  0.01uF  Voltage - Rated: 16V  package: 0402  [MC_S6/SM/C_0402_IPC]
C22  0.1uF  package: 0402  Voltage - Rated: 16V  [MC_S6/SM/C_0402_IPC]
C23  10uF  Voltage - Rated: 25V  package: 0805  [MC_S6/SM/C_0805_IPC]
C24  0.1uF  package: 0402  Voltage - Rated: 16V  [MC_S6/SM/C_0402_IPC]
C25  0.1uF  package: 0402  Voltage - Rated: 16V  [MC_S6/SM/C_0402_IPC]
C26  0.1uF  package: 0402  Voltage - Rated: 16V  [MC_S6/SM/C_0402_IPC]
C163  0.47uF  [MC_S6/SM/C_0402_IPC]  (value not drawn)
C164  0.47uF  [MC_S6/SM/C_0402_IPC]  (value not drawn)
R13  5.1k  Tolerance: ±0.1%  Supplier Device Package: 0402  [MC_S6/SM/R_0402_IPC]
R14  5.1k  Tolerance: ±0.1%  Supplier Device Package: 0402  [MC_S6/SM/R_0402_IPC]
R15  5.1k  Tolerance: ±0.1%  Supplier Device Package: 0402  [MC_S6/SM/R_0402_IPC]
R16  5.1k  Tolerance: ±0.1%  Supplier Device Package: 0402  [MC_S6/SM/R_0402_IPC]
R17  768R  Supplier Device Package: 0402  [MC_S6/SM/R_0402_IPC]
R18  768R  Supplier Device Package: 0402  [MC_S6/SM/R_0402_IPC]
R19  5.1k  Tolerance: ±0.1%  Supplier Device Package: 0402  [MC_S6/SM/R_0402_IPC]
R107  5.1k  Tolerance: ±0.1%  Supplier Device Package: 0402  [MC_S6/SM/R_0402_IPC]
R108  5.1k  Tolerance: ±0.1%  Supplier Device Package: 0402  [MC_S6/SM/R_0402_IPC]
U15  TLV2543CDB  [MC_S6/SM/ADC_DB20]
U16  LT1634ACS8-2.5  [MC_S6/SM/LT1634_SOIC8]
U18  TMP36GRTZ  [MC_S6/SM/SOT23_RJ5]
U19  TMP36GRTZ  [MC_S6/SM/SOT23_RJ5]
VREF  Test Point Via  [MC_S6/TH/TPVIA]  (value not drawn)  (no BOM)

### Ports
adc_eoc (out), adc_ncs (in), adc_sck (in), adc_sdi (in), adc_sdo (out), gbt_rx_rssi (in)

### Nets
+1V2: C17.1 U15.5(Ain4)
+1V5: C19.1 U15.7(Ain6)
+1V5A: C163.1 U15.8(Ain7)
+1V8: C16.1 U15.4(Ain3)
+2V5: R14.1
+2V5/2: C14.1 R14.2 R16.1 U15.2(Ain1)
+2V5/2_SFP: C164.1 R107.2 R108.1 U15.9(Ain8)
+2V5_SFP: R107.1
+3V3: C22.1 C23.1 C24.1 C26.1 R13.1 R19.1 U15.20(VCC) U18.2(+Vs) U18.4(~{SD}) U19.2(+Vs) U19.4(~{SD})
+3V3/2: C13.1 R13.2 R15.1 U15.1(Ain0)
+Vcore: C15.1 U15.3(Ain2)
GND: C13.2 C14.2 C15.2 C16.2 C17.2 C18.2 C19.2 C20.2 C21.2 C22.2 C23.2 C24.2 C25.2 C26.2 C163.2 C164.2 R15.2 R16.2 R108.2 U15.10(GND) U15.13(REF-) U16.4(GND) U16.5(TEST) U18.5(GND) U19.5(GND)
adc_eoc: U15.19(EOC) ; port adc_eoc
adc_ncs: U15.15(~{CS}) ; port adc_ncs
adc_sck: U15.18(SDCLK) ; port adc_sck
adc_sdi: U15.17(SDIN) ; port adc_sdi
adc_sdo: U15.16(SDOUT) ; port adc_sdo
gbt_rx_rssi: C18.1 U15.6(Ain5) ; port gbt_rx_rssi
VREF: C25.1 R19.2 U15.14(REF+) U16.6(Vout) VREF.1(In)
VTfpga: R17.1 U18.1(Vout)
VTfpga_adc: C20.1 R17.2 U15.11(Ain9)
VTgbtx: R18.1 U19.1(Vout)
VTgbtx_adc: C21.1 R18.2 U15.12(Ain10)

Not connected (* = marked no-connect by the designer): U18 3(NC); U19 3(NC)

### Layout directives
net class Power: +2V5/2, +2V5/2_SFP, +3V3/2, gbt_rx_rssi, VREF, VTfpga, VTfpga_adc, VTgbtx, VTgbtx_adc

### Notes on the sheet
- Divide voltages greater than 2.5V to fit in VREF range
- +1.65V
- (near R14) +1.25V
- (near R107) +1.25V
- 1.65v
- 1.25v
- 1.80v
- 1.20v
- gbt photocurrent
- SPI Bus
- 1.50V
- PCB Near FPGA
- +2.500V
- PCB Near GBTx
- (near U19) 10mV/C+500mV
- (near U19) TMP36 maximum load capacitance 10,000pF
- Date:
- Rev:
- of
- Sheet
- (in symbol C0402C103K4RACTU) .
- (in symbol C0402C104K4RACTU) .
- (in symbol GRM21BR61E106KA73L) .
- (in symbol GRM155R61A474KE15D) .

### Library data of the parts
C13-C19 C163 C164 = GRM155R61A474KE15D: CAP CER 0.47UF 10V X5R 0402; Manufacturer: Murata Electronics North America; Capacitance: 0.47µF; Tolerance: ±10%; Supplier 1: Digi-Key; Manufacturer Part Number: GRM155R61A474KE15D; RoHS: RoHS Compliant; Category: Capacitors; Stock 1: 506743; Pricing 1: 1=0.1, 10=0.064, 50=0.0344, 100=0.0292, 250=0.02384, 500=0.0204, 1000=0.0159, 5000=0.01325 (USD); Packaging: Cut Tape (CT); Part Status: Active; Operating Temperature: -55°C ~ 85°C; Features: -; Ratings: -; Applications: General Purpose; Mounting Type: Surface Mount, MLCC; Package / Case: 0402 (1005 Metric); Size / Dimension: 0.039" L x 0.020" W (1.00mm x 0.50mm); Height - Seated (Max): -; Thickness (Max): 0.022" (0.55mm); Lead Spacing: -; ComponentLink1URL: http://www.murata.com/~/media/webrenewal/support/library/catalog/products/capacitor/mlcc/c02e.pdf; ComponentLink1Description: http://www.murata.com/~/media/webrenewal/support/library/catalog/products/capacitor/mlcc/c02e.pdf; Supplier 2: Digi-Key; Stock 2: 506743; Pricing 2: 1=0.1, 10=0.064, 50=0.0344, 100=0.0292, 250=0.02384, 500=0.0204, 1000=0.0159, 5000=0.01325 (USD); Supplier Part Number 1: 490-3264-1-ND; Supplier Part Number 2: 490-3264-6-ND; Temperature Coefficient: X5R; Lead Style: -
  C14-C19 C163 C164: package: 0402; Voltage - Rated: 10V
C20 C21 = C0402C103K4RACTU: as C4 on sheet Power; Supplier 1: Digi-Key; Manufacturer Part Number: C0402C103K4RACTU; RoHS: RoHS Compliant; Category: Capacitors; Stock 1: 605739; Pricing 1: 1=0.1, 10=0.02, 25=0.0144, 50=0.0108, 100=0.0088, 250=0.00732, 500=0.00626, 1000=0.00492, 5000=0.00412 (USD); Packaging: Cut Tape (CT); Part Status: Active; Temperature Coefficient: X7R; Operating Temperature: -55°C ~ 125°C; Features: -; Ratings: -; Applications: General Purpose; Mounting Type: Surface Mount, MLCC; Package / Case: 0402 (1005 Metric); Size / Dimension: 0.039" L x 0.020" W (1.00mm x 0.50mm); Height - Seated (Max): -; Thickness (Max): 0.022" (0.55mm); Lead Spacing: -; Lead Style: -; ComponentLink1URL: http://www.kemet.com/docfinder?Partnumber=C0402C103K4RACTU; ComponentLink1Description: http://www.kemet.com/docfinder?Partnumber=C0402C103K4RACTU; Supplier 2: Digi-Key; Stock 2: 605739; Pricing 2: 1=0.1, 10=0.02, 25=0.0144, 50=0.0108, 100=0.0088, 250=0.00732, 500=0.00626, 1000=0.00492, 5000=0.00412 (USD); Supplier Part Number 1: 399-1038-1-ND; Supplier Part Number 2: 399-1038-6-ND; Failure Rate: -
C22 C24-C26 = C0402C104K4RACTU: as C162 on sheet Power; Supplier 1: Digi-Key; Manufacturer Part Number: C0402C104K4RACTU; RoHS: RoHS Compliant; Category: Capacitors; Stock 1: 3565698; Pricing 1: 1=0.11, 10=0.078, 25=0.0568, 50=0.0442, 100=0.0365, 250=0.03024, 500=0.02562, 1000=0.02121, 5000=0.01806 (USD); Packaging: Cut Tape (CT); Part Status: Active; Operating Temperature: -55°C ~ 125°C; Features: -; Ratings: -; Applications: General Purpose; Failure Rate: -; Mounting Type: Surface Mount, MLCC; Package / Case: 0402 (1005 Metric); Size / Dimension: 0.039" L x 0.020" W (1.00mm x 0.50mm); Height - Seated (Max): -; Thickness (Max): 0.022" (0.55mm); Lead Spacing: -; Lead Style: -; ComponentLink1URL: http://www.kemet.com/docfinder?Partnumber=C0402C104K4RACTU; ComponentLink1Description: http://www.kemet.com/docfinder?Partnumber=C0402C104K4RACTU; Supplier 2: Digi-Key; Stock 2: 3565998; Pricing 2: 1=0.11, 10=0.078, 25=0.0568, 50=0.0442, 100=0.0365, 250=0.03024, 500=0.02562, 1000=0.02121, 5000=0.01806 (USD); Supplier Part Number 1: 399-3521-1-ND; Supplier Part Number 2: 399-3521-6-ND; Temperature Coefficient: X7R
C23 = GRM21BR61E106KA73L: as C1-C3 on sheet Power; Supplier 1: Digi-Key; Manufacturer Part Number: GRM21BR61E106KA73L; RoHS: RoHS Compliant; Category: Capacitors; Stock 1: 607428; Pricing 1: 1=0.19, 10=0.13, 50=0.0748, 100=0.0618, 250=0.052, 500=0.04356, 1000=0.03575 (USD); Packaging: Cut Tape (CT); Part Status: Active; Temperature Coefficient: X5R; Operating Temperature: -55°C ~ 85°C; Features: -; Ratings: -; Applications: General Purpose; Mounting Type: Surface Mount, MLCC; Package / Case: 0805 (2012 Metric); Size / Dimension: 0.079" L x 0.049" W (2.00mm x 1.25mm); Height - Seated (Max): -; Thickness (Max): 0.053" (1.35mm); Lead Spacing: -; Lead Style: -; ComponentLink1URL: http://www.murata.com/~/media/webrenewal/support/library/catalog/products/capacitor/mlcc/c02e.pdf; ComponentLink1Description: http://www.murata.com/~/media/webrenewal/support/library/catalog/products/capacitor/mlcc/c02e.pdf; Supplier 2: Digi-Key; Supplier Part Number 1: 490-5523-1-ND; Supplier Part Number 2: 490-5523-6-ND
R13-R16 R19 R107 R108 = ERA-2AEB512X: as R7 on sheet Power; Supplier 1: Digi-Key; Manufacturer Part Number: ERA-2AEB512X; RoHS: RoHS Compliant; Category: Resistors; Stock 1: 26098; Pricing 1: 1=0.61, 50=0.238, 100=0.1913, 250=0.14876, 500=0.1122, 1000=0.0867, 5000=0.0646 (USD); Packaging: Cut Tape (CT); Part Status: Active; Resistance (Ohms): 5.1k; Composition: Thin Film; Features: Automotive AEC-Q200; Operating Temperature: -55°C ~ 155°C; Package / Case: 0402 (1005 Metric); Size / Dimension: 0.039" L x 0.020" W (1.00mm x 0.50mm); Height - Seated (Max): 0.016" (0.40mm); Number of Terminations: 2; Failure Rate: -; ComponentLink1URL: https://industrial.panasonic.com/cdbs/www-data/pdf/RDA0000/AOA0000C237.pdf; ComponentLink1Description: https://industrial.panasonic.com/cdbs/www-data/pdf/RDA0000/AOA0000C237.pdf; Supplier 2: Digi-Key; Stock 2: 26098; Pricing 2: 1=0.61, 50=0.238, 100=0.1913, 250=0.14876, 500=0.1122, 1000=0.0867, 5000=0.0646 (USD); Supplier Part Number 1: P5.1KDCCT-ND; Supplier Part Number 2: P5.1KDCDKR-ND
R17 R18 = ERJ-2RKF7680X: RES SMD 768 OHM 5.0% 1/10W 0402; Manufacturer: Panasonic Electronic Components; Tolerance: ±1%; Power (Watts): 0.1W, 1/10W; Temperature Coefficient: ±100ppm/°C; Supplier 1: Digi-Key; Manufacturer Part Number: ERJ-2RKF7680X; RoHS: RoHS Compliant; Category: Resistors; Stock 1: 54378; Pricing 1: 1=0.1, 10=0.039, 100=0.016, 1000=0.00719, 2500=0.00624, 5000=0.00515 (USD); Packaging: Cut Tape (CT); Part Status: Active; Composition: Thick Film; Features: Automotive AEC-Q200; Operating Temperature: -55°C ~ 155°C; Package / Case: 0402 (1005 Metric); Size / Dimension: 0.039" L x 0.020" W (1.00mm x 0.50mm); Height - Seated (Max): 0.016" (0.40mm); Failure Rate: -; ComponentLink1URL: https://industrial.panasonic.com/cdbs/www-data/pdf/RDA0000/AOA0000C304.pdf; ComponentLink1Description: https://industrial.panasonic.com/cdbs/www-data/pdf/RDA0000/AOA0000C304.pdf; Supplier 2: Digi-Key; Stock 2: 54378; Pricing 2: 1=0.1, 10=0.039, 100=0.016, 1000=0.00719, 2500=0.00624, 5000=0.00515 (USD); Supplier Part Number 1: P768LCT-ND; Supplier Part Number 2: P768LDKR-ND
U15 = TLV2543CDB: IC SERIAL OUT A/D 11-CH 20-SSOP; Manufacturer: Texas Instruments; Manufacturer Part Number: TLV2543CDBR; COMPSIDE: TOP; COMPGROUP: 0; COMPROT: 270; mfgr: Texas Inst; mfgr_foot: DB20; Number of Bits: 12; Sampling Rate (Per Second): 66k; Number of Inputs: 11; Input Type: Single Ended; Data Interface: SPI; Configuration: MUX-S/H-ADC; Ratio - S/H:ADC: 1:1; Number of A/D Converters: 1; Architecture: SAR; Reference Type: External; Voltage - Supply, Analog: 3 V ~ 3.6 V; mfgr_id: TLV2543CDB; Supplier 1: Digi-Key; RoHS: RoHS Compliant; Category: Integrated Circuits (ICs); Stock 1: 505; Pricing 1: 1=12.64, 10=11.596, 100=9.7894, 500=8.68224, 1000=7.98299 (USD); Packaging: Cut Tape (CT); Part Status: Active; Voltage - Supply, Digital: 3 V ~ 3.6 V; Features: -; Operating Temperature: 0°C ~ 70°C; Package / Case: 20-SSOP (0.209", 5.30mm Width); Supplier Device Package: 20-SSOP; ComponentLink1URL: http://www.ti.com/lit/ds/symlink/tlv2543.pdf; ComponentLink1Description: http://www.ti.com/lit/ds/symlink/tlv2543.pdf; Supplier 2: Digi-Key; Stock 2: 505; Pricing 2: 1=12.64, 10=11.596, 100=9.7894, 500=8.68224, 1000=7.98299 (USD); Supplier Part Number 1: 296-10643-1-ND; Supplier Part Number 2: 296-10643-6-ND
U16 = LT1634_2.5V: IC VREF SHUNT 2.5V 8SOIC; Manufacturer: Linear Technology; Manufacturer Part Number: LT1634ACS8-2.5#PBF; COMPSIDE: TOP; COMPGROUP: 0; COMPROT: 270; mfgr: Linear Tech; mfgr_foot: SOIC8; Output Type: Fixed; Current - Output: 50mA; Tolerance: ±0.05%; Temperature Coefficient: 10ppm/°C; Noise - 0.1Hz to 10Hz: 15µVp-p; Current - Cathode: 8µA; mfgr_id: LT1634ACS8-2.5; Supplier 1: Digi-Key; RoHS: RoHS Compliant; Category: Integrated Circuits (ICs); Stock 1: 1010; Pricing 1: 1=9.42, 25=6.256, 100=4.7109 (USD); Packaging: Tube; Part Status: Active; Reference Type: Shunt; Voltage - Output (Min/Fixed): 2.5V; Voltage - Output (Max): -; Noise - 10Hz to 10kHz: -; Voltage - Input: -; Current - Supply: -; Operating Temperature: 0°C ~ 70°C (TA); Mounting Type: Surface Mount; Package / Case: 8-SOIC (0.154", 3.90mm Width); Supplier Device Package: 8-SOIC; ComponentLink1URL: http://www.linear.com/docs/3209; ComponentLink1Description: http://www.linear.com/docs/3209; Supplier Part Number 1: LT1634ACS8-2.5#PBF-ND
U18 U19 = TMP36GRTZ: SENSOR TEMP ANLG VOLT SOT-23-5; Manufacturer: Analog Devices; Manufacturer Part Number: TMP36GRTZ-REEL7; Output Type: Analog; Description: ANALOG DEVICES         TMP36GRTZ-REEL7            Temperature Sensor IC, Voltage,  3C, -40 C, +125 C, SOT-23, 5 Pins; Min Supply Voltage: 2.7V; Max Supply Voltage: 5.5V; Operating Supply Current: 50uA; Supplier 1: Digi-Key; Stock 1: 18393; Pricing 1: 1=1.75, 10=1.574, 100=1.2652, 500=1.0395, 1000=0.8613 (USD); Packaging: Tape and Reel; ComponentLink1URL: http://www.analog.com/media/en/technical-documentation/data-sheets/TMP35_36_37.pdf; ComponentLink1Description: http://www.analog.com/media/en/technical-documentation/data-sheets/TMP35_36_37.pdf; Supplier Part Number 1: TMP36GRTZ-REEL7CT-ND; Case/Package: SOT-23; Number of Pins: 5; Min Operating Temperature: -40°C; Max Operating Temperature: 125°C; Interface: Analog; Package Quantity: 3000; Nominal Supply Current: 50uA; Output Current: 50uA; Length: 3mm; Height: 1.3mm; Width: 1.7mm; Radiation Hardening: No; REACH SVHC: No SVHC; Lead Free: Contains Lead
VREF = TPVIA: as 1V2_INT on sheet Power; COMPROT: 0; Package: 90; mfgr_id: TPVIA; mfgr_foot: TPVIA

## Sheet Mechanical.SchDoc: Mechanical
size A; Organization: UCLA High Energy Physics; DocumentNumber: 23; Revision: 2.0; SheetNumber: 23; SheetTotal: 23; CurrentDate: 9/6/2018; ModifiedDate: 9/6/2018; ProjectName: ALCT S-6 Optical Mezzanine
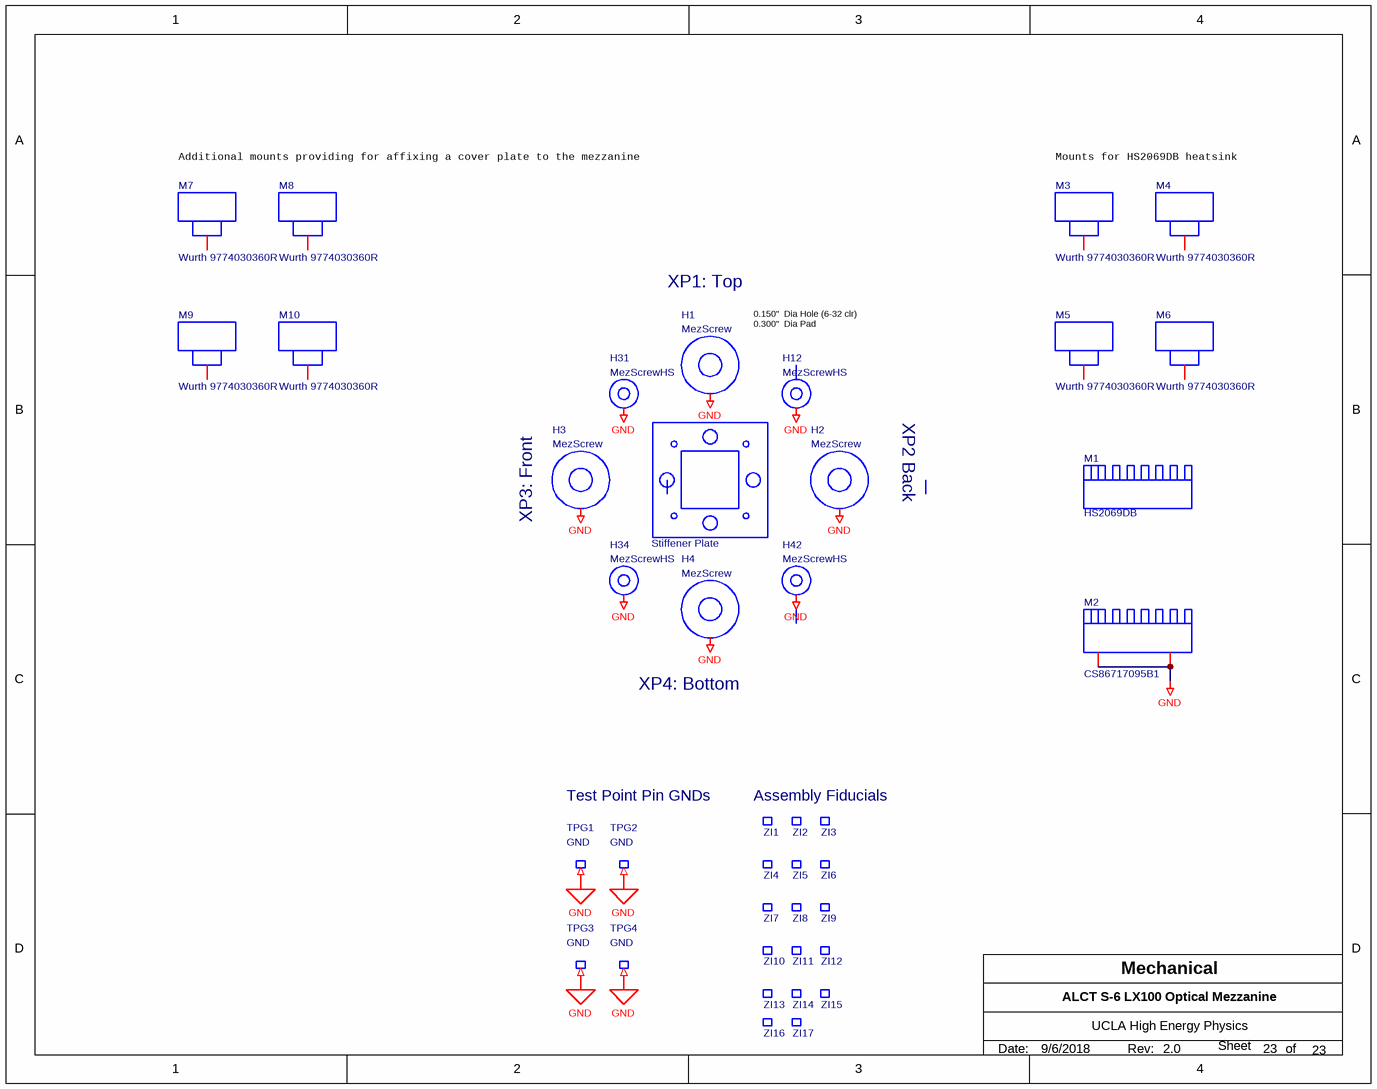
[diagram p14: Mechanical.SchDoc]

### Parts
H1  MezScrew  [MC_S6/TH/SCREW_BASE]  (no BOM)
H2  MezScrew  [MC_S6/TH/SCREW_BASE]  (no BOM)
H3  MezScrew  [MC_S6/TH/SCREW_BASE]  (no BOM)
H4  MezScrew  [MC_S6/TH/SCREW_BASE]  (no BOM)
H12  MezScrewHS  [MC_S6/TH/SCREW_PLATE]  (no BOM)
H31  MezScrewHS  [MC_S6/TH/SCREW_PLATE]  (no BOM)
H34  MezScrewHS  [MC_S6/TH/SCREW_PLATE]  (no BOM)
H42  MezScrewHS  [MC_S6/TH/SCREW_PLATE]  (no BOM)
M1  HS2069DB  [HS2069DB]  (no BOM)
M2  CS86717095B1  [CS86717095B1]  (no BOM)
M3  Wurth 9774030360R  [Wurth/9774020360R]
M4  Wurth 9774030360R  [Wurth/9774020360R]
M5  Wurth 9774030360R  [Wurth/9774020360R]
M6  Wurth 9774030360R  [Wurth/9774020360R]
M7  Wurth 9774030360R  [Wurth/9774020360R]
M8  Wurth 9774030360R  [Wurth/9774020360R]
M9  Wurth 9774030360R  [Wurth/9774020360R]
M10  Wurth 9774030360R  [Wurth/9774020360R]
SP1  Stiffener Plate  [MC_S6/SPLATE]  (no BOM)
TPG1  GND  [MC_S6/TH/TPGND]  (no BOM)
TPG2  GND  [MC_S6/TH/TPGND]  (no BOM)
TPG3  GND  [MC_S6/TH/TPGND]  (no BOM)
TPG4  GND  [MC_S6/TH/TPGND]  (no BOM)
ZI1  Fiducial Dot  [MC_S6/SM/FIDUCIAL_DOT]  (value not drawn)  (no BOM)
ZI2  Fiducial Dot  [MC_S6/SM/FIDUCIAL_DOT]  (value not drawn)  (no BOM)
ZI3  Fiducial Dot  [MC_S6/SM/FIDUCIAL_DOT]  (value not drawn)  (no BOM)
ZI4  Fiducial Dot  [MC_S6/SM/FIDUCIAL_DOT]  (value not drawn)  (no BOM)
ZI5  Fiducial Dot  [MC_S6/SM/FIDUCIAL_DOT]  (value not drawn)  (no BOM)
ZI6  Fiducial Dot  [MC_S6/SM/FIDUCIAL_DOT]  (value not drawn)  (no BOM)
ZI7  Fiducial Dot  [MC_S6/SM/FIDUCIAL_DOT]  (value not drawn)  (no BOM)
ZI8  Fiducial Dot  [MC_S6/SM/FIDUCIAL_DOT]  (value not drawn)  (no BOM)
ZI9  Fiducial Dot  [MC_S6/SM/FIDUCIAL_DOT]  (value not drawn)  (no BOM)
ZI10  Fiducial Dot  [MC_S6/SM/FIDUCIAL_DOT]  (value not drawn)  (no BOM)
ZI11  Fiducial Dot  [MC_S6/SM/FIDUCIAL_DOT]  (value not drawn)  (no BOM)
ZI12  Fiducial Dot  [MC_S6/SM/FIDUCIAL_DOT]  (value not drawn)  (no BOM)
ZI13  Fiducial Dot  [MC_S6/SM/FIDUCIAL_DOT]  (value not drawn)  (no BOM)
ZI14  Fiducial Dot  [MC_S6/SM/FIDUCIAL_DOT]  (value not drawn)  (no BOM)
ZI15  Fiducial Dot  [MC_S6/SM/FIDUCIAL_DOT]  (value not drawn)  (no BOM)
ZI16  Fiducial Dot  [MC_S6/SM/FIDUCIAL_DOT]  (value not drawn)  (no BOM)
ZI17  Fiducial Dot  [MC_S6/SM/FIDUCIAL_DOT]  (value not drawn)  (no BOM)

### Nets
GND: H1.1(GND) H2.1(GND) H3.1(GND) H4.1(GND) H12.1(GND) H31.1(GND) H34.1(GND) H42.1(GND) M2.1 M2.2 TPG1.1(In) TPG2.1(In) TPG3.1(In) TPG4.1(In)

Not connected (* = marked no-connect by the designer): M3 1; M4 1; M5 1; M6 1; M7 1; M8 1; M9 1; M10 1; ZI1 1(NC); ZI2 1(NC); ZI3 1(NC); ZI4 1(NC); ZI5 1(NC); ZI6 1(NC); ZI7 1(NC); ZI8 1(NC); ZI9 1(NC); ZI10 1(NC); ZI11 1(NC); ZI12 1(NC); ZI13 1(NC); ZI14 1(NC); ZI15 1(NC); ZI16 1(NC); ZI17 1(NC)

### Notes on the sheet
- Additional mounts providing for affixing a cover plate to the mezzanine
- Mounts for HS2069DB heatsink
- XP1: Top
- 0.150"  Dia Hole (6-32 clr)
  0.300"  Dia Pad
- XP2 Back
- (near H3) XP3: Front
- (near H4) XP4: Bottom
- Test Point Pin GNDs
- Assembly Fiducials
- Date:
- Rev:
- of
- Sheet

### Library data of the parts
H1-H4 = MezScrew: COMPSIDE: TOP; COMPGROUP: 0; mfgr_id: 92949A146; mfgr: McMaster; mfgr_foot: 6-32 ButtonSkt; COMPROT: 0
H12 H31 H34 H42 = MezScrewHS: mfgr_foot: 6-32 ButtonSkt; mfgr: McMaster; mfgr_id: 92949A146; COMPROT: 0; COMPSIDE: TOP; COMPGROUP: 0
M1 = HS2069DB: Heatsink 61 x 58 x 12mm
M2 = CS86717095B1: Heatsink 17 x 17 x 9.5mm
M3-M10 = Wurth/9774030360R: 9774030360R 3mm SMD Standoff; Manufacturer: Wurth Electronics; Plating: Tin; Threaded/Unthreaded: Threaded; Outside Diameter: 0.236inch; Thread Size: M3; Supplier 1: Digi-Key; Manufacturer Part Number: 9774030360R; Stock 1: 18011; Pricing 1: 1=1.65, 10=1.523, 50=1.411, 100=1.21 (USD); Mount: External; Case/Package: SMD/SMT; Material: Steel; Length: 0.173inch; Width: 6mm; REACH SVHC: Unknown; Lead Free: Lead Free; ComponentLink1URL: https://datasheet.ciiva.com/46421/1849514-46421897.pdf; ComponentLink1Description: https://datasheet.ciiva.com/46421/1849514-46421897.pdf; Supplier Part Number 1: 732-5270-6-ND
SP1 = SPlate_MC_S6
TPG1-TPG4 = TPGND: mfgr_id: 2341; mfgr: Mill-Max; mfgr_foot: Turret; silk: What; COMPROT: 0; COMPSIDE: TOP; Package: 90; COMPGROUP: 0
ZI1-ZI17 = Fiducial_dot: mfgr_foot: FID; mfgr: Layout; COMPROT: 0; COMPSIDE: TOP; mfgr_id: FID; Package: 90; COMPGROUP: 0

## Sheet DSN.SchDoc: Digital Serial Number
size A; Organization: UCLA High Energy Physics; Address1: L3, 12a Rodborough Rd; Address2: Frenchs Forest; Address3: NSW; Address4: Australia 2086; DocumentNumber: 20; Revision: 2.0; SheetNumber: 20; SheetTotal: 23; CurrentDate: 9/6/2018; ModifiedDate: 9/6/2018; ProjectName: Project
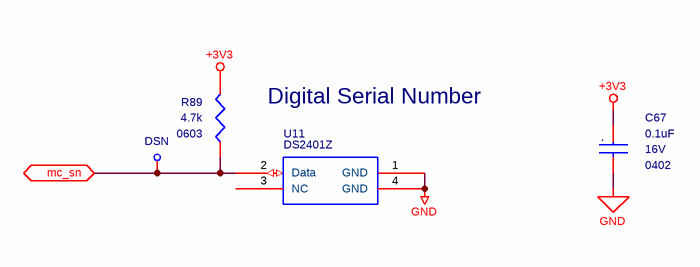
[diagram p15: DSN.SchDoc]

### Parts
C67  0.1uF  package: 0402  Voltage - Rated: 16V  [MC_S6/SM/C_0402_IPC]
DSN  Test Point Via  [MC_S6/TH/TPVIA]  (value not drawn)  (no BOM)
R89  4.7k  Supplier Device Package: 0603  [MC_S6/SM/R_0603_IPC]
U11  DS2401Z  [MC_S6/SM/SOT223_1243]

### Ports
mc_sn (bidir)

### Nets
+3V3: C67.1 R89.1
GND: C67.2 U11.1(GND) U11.4(GND)
mc_sn: DSN.1(In) R89.2 U11.2(Data) ; port mc_sn

Not connected (* = marked no-connect by the designer): U11 3(NC)

### Notes on the sheet
- Digital Serial Number
- Date:
- Rev:
- of
- Sheet
- (in symbol C0402C104K4RACTU) .

### Library data of the parts
C67 = C0402C104K4RACTU: as C162 on sheet Power; Supplier 1: Digi-Key; Manufacturer Part Number: C0402C104K4RACTU; RoHS: RoHS Compliant; Category: Capacitors; Stock 1: 3565698; Pricing 1: 1=0.11, 10=0.078, 25=0.0568, 50=0.0442, 100=0.0365, 250=0.03024, 500=0.02562, 1000=0.02121, 5000=0.01806 (USD); Packaging: Cut Tape (CT); Part Status: Active; Operating Temperature: -55°C ~ 125°C; Features: -; Ratings: -; Applications: General Purpose; Failure Rate: -; Mounting Type: Surface Mount, MLCC; Package / Case: 0402 (1005 Metric); Size / Dimension: 0.039" L x 0.020" W (1.00mm x 0.50mm); Height - Seated (Max): -; Thickness (Max): 0.022" (0.55mm); Lead Spacing: -; Lead Style: -; ComponentLink1URL: http://www.kemet.com/docfinder?Partnumber=C0402C104K4RACTU; ComponentLink1Description: http://www.kemet.com/docfinder?Partnumber=C0402C104K4RACTU; Supplier 2: Digi-Key; Stock 2: 3565998; Pricing 2: 1=0.11, 10=0.078, 25=0.0568, 50=0.0442, 100=0.0365, 250=0.03024, 500=0.02562, 1000=0.02121, 5000=0.01806 (USD); Supplier Part Number 1: 399-3521-1-ND; Supplier Part Number 2: 399-3521-6-ND; Temperature Coefficient: X7R
DSN = TPVIA: as 1V2_INT on sheet Power; COMPROT: 0; Package: 90; mfgr_id: TPVIA; mfgr_foot: TPVIA
R89 = CR0603-FX-4701ELF: as R3 on sheet Power; Supplier 1: Digi-Key; Manufacturer Part Number: CR0603-FX-4701ELF; RoHS: RoHS Compliant; Category: Resistors; Stock 1: 43560; Pricing 1: 1=0.1, 10=0.021, 100=0.0086, 1000=0.00385, 2500=0.00334 (USD); Packaging: Cut Tape (CT); Part Status: Active; Resistance (Ohms): 4.7k; Composition: Thick Film; Features: Moisture Resistant; Operating Temperature: -55°C ~ 155°C; Package / Case: 0603 (1608 Metric); Size / Dimension: 0.063" L x 0.031" W (1.60mm x 0.80mm); Height - Seated (Max): 0.022" (0.55mm); Failure Rate: -; ComponentLink1URL: http://www.bourns.com/docs/Product-Datasheets/CHPREZTR.pdf; ComponentLink1Description: http://www.bourns.com/docs/Product-Datasheets/CHPREZTR.pdf; Supplier 2: Digi-Key; Stock 2: 43560; Pricing 2: 1=0.1, 10=0.021, 100=0.0086, 1000=0.00385, 2500=0.00334 (USD); Supplier Part Number 1: CR0603-FX-4701ELFCT-ND; Supplier Part Number 2: CR0603-FX-4701ELFDKR-ND; Tolerance: ±1%
U11 = DS2401_sot223: IC Digital Serial Number; Manufacturer: Maxim Integrated; Manufacturer Part Number: DS2401Z+T&R; Supplier 1: Digi-Key; RoHS: RoHS Compliant; Category: Integrated Circuits (ICs); Stock 1: 8136; Pricing 1: 1=2, 10=1.89, 25=1.51, 50=1.43, 100=1.32, 250=1.25, 500=1.21 (USD); Packaging: Cut Tape (CT); Part Status: Active; Type: Silicon Serial Number; Applications: PCB, Network Node, Equipment Identification/Registration; Mounting Type: Surface Mount; Package / Case: TO-261-4, TO-261AA; Supplier Device Package: SOT-223-3; ComponentLink1URL: http://pdfserv.maximintegrated.com/en/ds/DS2401.pdf; ComponentLink1Description: http://pdfserv.maximintegrated.com/en/ds/DS2401.pdf; Supplier 2: Digi-Key; Stock 2: 8136; Pricing 2: 1=2, 10=1.89, 25=1.51, 50=1.43, 100=1.32, 250=1.25, 500=1.21 (USD); Supplier Part Number 1: DS2401Z+T&RCT-ND; Supplier Part Number 2: DS2401Z+T&RDKR-ND